# Altium schematic sheet P09.Power.SchDoc
size A4
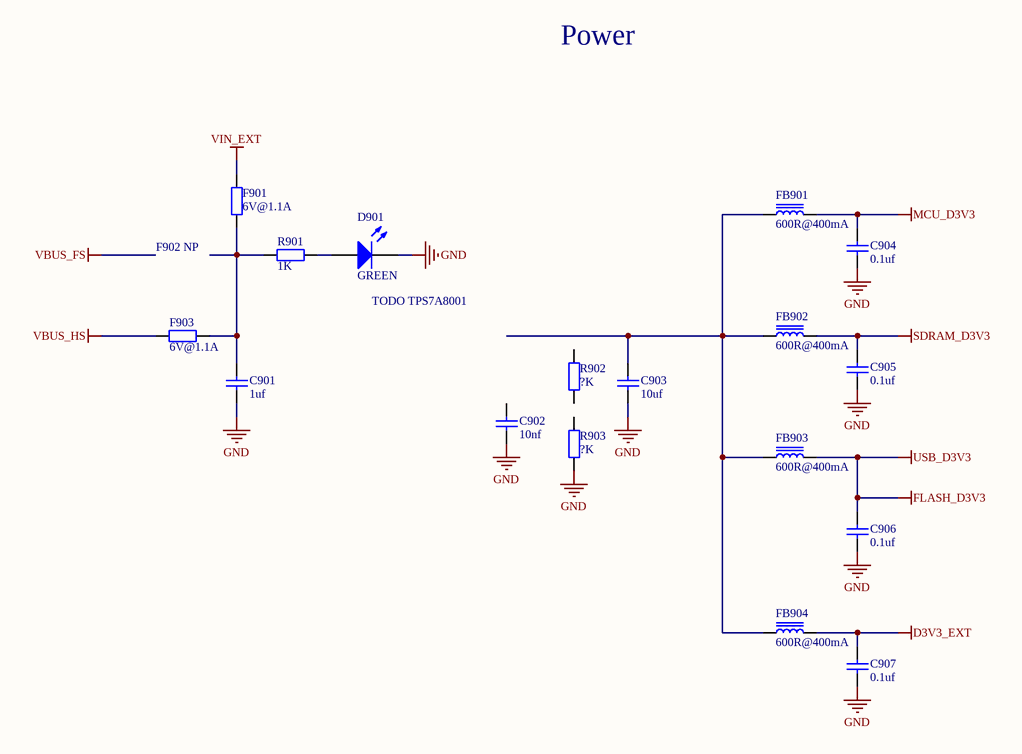
[diagram p0: P09.Power.SchDoc]

## Parts
C901  value 1uf  [C0603]  (hidden comment: Cap)
C902  value 10nf  [C0603]  (hidden comment: Cap)
C903  value 10uf  [C0805]  (hidden comment: Cap)
C904  value 0.1uf  [C0603]  (hidden comment: Cap)
C905  value 0.1uf  [C0603]  (hidden comment: Cap)
C906  value 0.1uf  [C0603]  (hidden comment: Cap)
C907  value 0.1uf  [C0603]  (hidden comment: Cap)
D901  value GREEN  [LED0603]  (hidden comment: LED)
F901  value 6V@1.1A  [F0805]  (hidden comment: Fuse)
F903  value 6V@1.1A  [F0805]  (hidden comment: Fuse)
FB901  value 600R@400mA  [FB0603]  (hidden comment: Ferrite Bead)
FB902  value 600R@400mA  [FB0603]  (hidden comment: Ferrite Bead)
FB903  value 600R@400mA  [FB0603]  (hidden comment: Ferrite Bead)
FB904  value 600R@400mA  [FB0603]  (hidden comment: Ferrite Bead)
R901  value 1K  [R0603]  (hidden comment: Res)
R902  value ?K  [R0603]  (hidden comment: Res)
R903  value ?K  [R0603]  (hidden comment: Res)

## Nets
D3V3_EXT: C907.2 FB904.2
FLASH_D3V3: C906.2 FB903.2  [also labelled USB_D3V3]
GND: C901.1 C902.1 C903.1 C904.1 C905.1 C906.1 C907.1 D901.2(K) R903.1
MCU_D3V3: C904.2 FB901.2
SDRAM_D3V3: C905.2 FB902.2
VBUS_HS: F903.1
VIN_EXT: F901.2
NetC901_2: C901.2 F901.1 F903.2 R901.1
NetC903_2: C903.2 FB901.1 FB902.1 FB903.1 FB904.1
NetD901_1: D901.1(A) R901.2

Not connected (* = marked no-connect by the designer): C902 2; R902 1 2; R903 2

## Notes on the sheet
- Power
- (near F901) F902 NP
- (near D901) TODO TPS7A8001

## Library data of the parts
R901-R903 = Res: 电阻